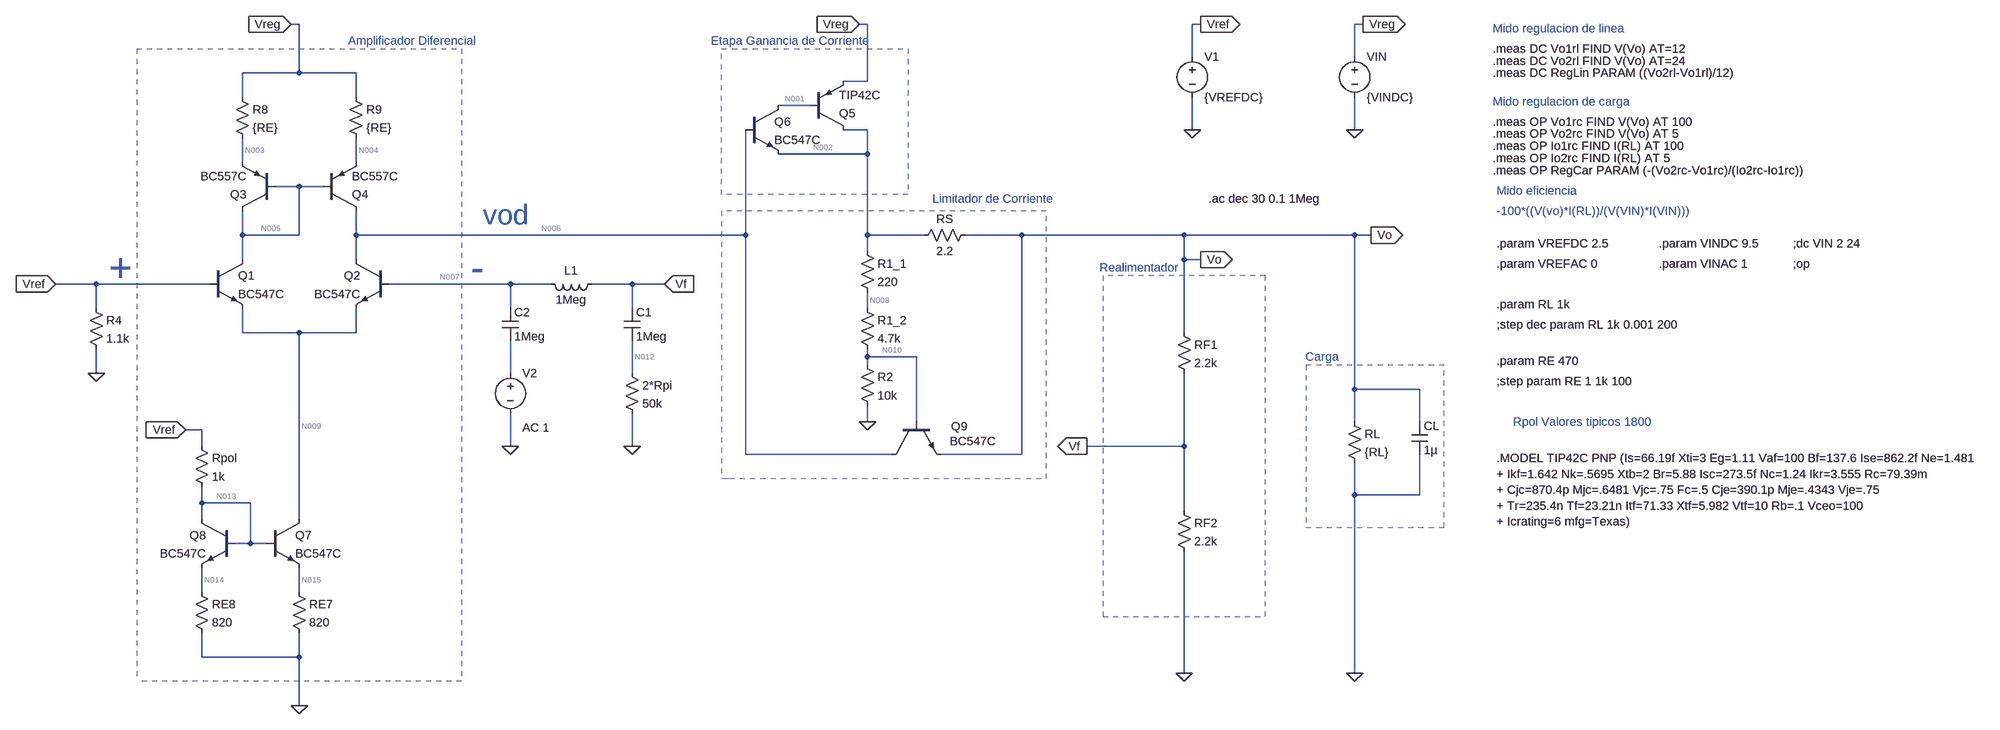
[diagram p0: schematic Ganancia de Lazo de Tension.asc]
Ganancia de Lazo de Tension.asc, the LTspice schematic file:
Version 4
SHEET 1 3616 1188
WIRE 208 -224 192 -224
WIRE 1328 -224 1312 -224
WIRE 1984 -224 1968 -224
WIRE 2304 -224 2288 -224
WIRE 1968 -160 1968 -224
WIRE 2288 -160 2288 -224
WIRE 208 -128 208 -224
WIRE 208 -128 96 -128
WIRE 320 -128 208 -128
WIRE 1328 -112 1328 -224
WIRE 1328 -112 1280 -112
WIRE 96 -80 96 -128
WIRE 320 -80 320 -128
WIRE 1216 -64 1152 -64
WIRE 1328 -16 1280 -16
WIRE 1968 -16 1968 -80
WIRE 2288 -16 2288 -80
WIRE 1328 32 1328 -16
WIRE 1328 32 1152 32
WIRE 96 48 96 0
WIRE 320 48 320 0
WIRE 208 96 160 96
WIRE 256 96 208 96
WIRE 96 192 96 144
WIRE 208 192 208 96
WIRE 208 192 96 192
WIRE 320 192 320 144
WIRE 1088 192 1088 -16
WIRE 1088 192 320 192
WIRE 1328 192 1328 32
WIRE 1440 192 1328 192
WIRE 1632 192 1520 192
WIRE 1952 192 1632 192
WIRE 2288 192 1952 192
WIRE 2320 192 2288 192
WIRE 1328 224 1328 192
WIRE 96 240 96 192
WIRE 320 240 320 192
WIRE 1952 240 1952 192
WIRE 1984 240 1952 240
WIRE -192 288 -272 288
WIRE 32 288 -192 288
WIRE 624 288 384 288
WIRE 704 288 624 288
WIRE 864 288 784 288
WIRE 928 288 864 288
WIRE -192 336 -192 288
WIRE 624 336 624 288
WIRE 864 336 864 288
WIRE 1328 336 1328 304
WIRE 96 384 96 336
WIRE 208 384 96 384
WIRE 320 384 320 336
WIRE 320 384 208 384
WIRE 1952 384 1952 240
WIRE 1328 432 1328 416
WIRE 1424 432 1328 432
WIRE 1328 448 1328 432
WIRE -192 464 -192 416
WIRE 624 464 624 400
WIRE 864 464 864 400
WIRE 2288 496 2288 192
WIRE 2416 496 2288 496
WIRE 1328 560 1328 528
WIRE 1424 560 1424 432
WIRE 2288 560 2288 496
WIRE 2416 560 2416 496
WIRE 16 576 -16 576
WIRE 16 608 16 576
WIRE 624 608 624 544
WIRE 864 608 864 544
WIRE 1952 608 1952 464
WIRE 1952 608 1760 608
WIRE 1088 624 1088 192
WIRE 1376 624 1088 624
WIRE 1632 624 1632 192
WIRE 1632 624 1472 624
WIRE 2288 704 2288 640
WIRE 2416 704 2416 624
WIRE 2416 704 2288 704
WIRE 16 720 16 688
WIRE 112 720 16 720
WIRE 1952 736 1952 608
WIRE 16 752 16 720
WIRE 208 752 208 384
WIRE 112 800 112 720
WIRE 112 800 80 800
WIRE 144 800 112 800
WIRE 16 896 16 848
WIRE 208 896 208 848
WIRE 16 1024 16 976
WIRE 208 1024 208 976
WIRE 208 1024 16 1024
WIRE 1952 1056 1952 816
WIRE 2288 1056 2288 704
WIRE 208 1120 208 1024
FLAG 2320 192 Vo
IOPIN 2320 192 Out
FLAG 1984 -224 Vref
IOPIN 1984 -224 Out
FLAG 1760 608 Vf
IOPIN 1760 608 Out
FLAG 1968 -16 0
FLAG 2304 -224 Vreg
IOPIN 2304 -224 Out
FLAG 2288 1056 0
FLAG 1952 1056 0
FLAG -272 288 Vref
IOPIN -272 288 In
FLAG -16 576 Vref
IOPIN -16 576 In
FLAG 2288 -16 0
FLAG 1312 -224 Vreg
IOPIN 1312 -224 In
FLAG 1328 560 0
FLAG -192 464 0
FLAG 928 288 Vf
IOPIN 928 288 In
FLAG 192 -224 Vreg
IOPIN 192 -224 In
FLAG 208 1120 0
FLAG 1984 240 Vo
IOPIN 1984 240 Out
FLAG 864 608 0
FLAG 624 608 0
DATAFLAG 16 288 ""
DATAFLAG 368 192 ""
DATAFLAG 112 192 ""
DATAFLAG 224 96 ""
DATAFLAG 320 32 ""
SYMBOL pnp 160 144 R180
SYMATTR InstName Q3
SYMATTR Value BC557C
SYMBOL pnp 256 144 M180
SYMATTR InstName Q4
SYMATTR Value BC557C
SYMBOL npn 32 240 R0
SYMATTR InstName Q1
SYMATTR Value BC547C
SYMBOL npn 384 240 M0
SYMATTR InstName Q2
SYMATTR Value BC547C
SYMBOL pnp 1216 -16 M180
SYMATTR InstName Q5
SYMATTR Value TIP42C
SYMBOL npn 1088 -64 R0
SYMATTR InstName Q6
SYMATTR Value BC547C
SYMBOL res 1936 368 R0
SYMATTR InstName RF1
SYMATTR Value 2.2k
SYMBOL res 1936 720 R0
SYMATTR InstName RF2
SYMATTR Value 2.2k
SYMBOL res 2272 544 R0
SYMATTR InstName RL
SYMATTR Value {RL}
SYMBOL voltage 1968 -176 R0
WINDOW 123 24 124 Left 2
WINDOW 39 0 0 Left 0
SYMATTR InstName V1
SYMATTR Value {VREFDC}
SYMBOL res 80 -96 R0
SYMATTR InstName R8
SYMATTR Value {RE}
SYMBOL res 304 -96 R0
SYMATTR InstName R9
SYMATTR Value {RE}
SYMBOL cap 2400 560 R0
SYMATTR InstName CL
SYMATTR Value 1µ
SYMBOL voltage 2288 -176 R0
WINDOW 123 24 124 Left 2
WINDOW 39 0 0 Left 0
SYMATTR InstName VIN
SYMATTR Value {VINDC}
SYMBOL npn 144 752 R0
SYMATTR InstName Q7
SYMATTR Value BC547C
SYMBOL npn 80 752 M0
SYMATTR InstName Q8
SYMATTR Value BC547C
SYMBOL res 0 592 R0
SYMATTR InstName Rpol
SYMATTR Value 1k
SYMBOL npn 1376 560 M90
WINDOW 0 9 117 VRight 2
WINDOW 3 38 114 VRight 2
SYMATTR InstName Q9
SYMATTR Value BC547C
SYMBOL res 1536 176 R90
WINDOW 0 0 56 VBottom 2
WINDOW 3 32 56 VTop 2
SYMATTR InstName RS
SYMATTR Value 2.2
SYMBOL res 1312 432 R0
SYMATTR InstName R2
SYMATTR Value 10k
SYMBOL res 1312 208 R0
SYMATTR InstName R1_1
SYMATTR Value 220
SYMBOL res -208 320 R0
SYMATTR InstName R4
SYMATTR Value 1.1k
SYMBOL res 192 880 R0
SYMATTR InstName RE7
SYMATTR Value 820
SYMBOL res 0 880 R0
SYMATTR InstName RE8
SYMATTR Value 820
SYMBOL res 1312 320 R0
SYMATTR InstName R1_2
SYMATTR Value 4.7k
SYMBOL res 848 448 R0
SYMATTR InstName 2*Rpi
SYMATTR Value 50k
SYMBOL ind 800 272 R90
WINDOW 0 5 56 VBottom 2
WINDOW 3 32 56 VTop 2
SYMATTR InstName L1
SYMATTR Value 1Meg
SYMBOL cap 848 336 R0
SYMATTR InstName C1
SYMATTR Value 1Meg
SYMBOL cap 608 336 R0
SYMATTR InstName C2
SYMATTR Value 1Meg
SYMBOL voltage 624 448 R0
WINDOW 123 24 124 Left 2
WINDOW 39 0 0 Left 0
SYMATTR InstName V2
SYMATTR Value ""
SYMATTR Value2 AC 1
TEXT 3152 248 Left 2 !;op
TEXT 2888 208 Left 2 !.param VINDC 9.5
TEXT 2888 248 Left 2 !.param VINAC 1
TEXT 2568 208 Left 2 !.param VREFDC 2.5
TEXT 2568 248 Left 2 !.param VREFAC 0
TEXT 2568 328 Left 2 !.param RL 1k
TEXT 3152 208 Left 2 !;dc VIN 2 24
TEXT 2568 480 Left 2 !;step param RE 1 1k 100
TEXT 2568 440 Left 2 !.param RE 470
TEXT 2568 368 Left 2 !;step dec param RL 1k 0.001 200
TEXT 2560 -216 Left 2 ;Mido regulacion de linea
TEXT 2560 -176 Left 2 !.meas DC Vo1rl FIND V(Vo) AT=12
TEXT 2560 -152 Left 2 !.meas DC Vo2rl FIND V(Vo) AT=24
TEXT 2560 -128 Left 2 !.meas DC RegLin PARAM ((Vo2rl-Vo1rl)/12)
TEXT 2560 -72 Left 2 ;Mido regulacion de carga
TEXT 2560 -32 Left 2 !.meas OP Vo1rc FIND V(Vo) AT 100
TEXT 2560 -8 Left 2 !.meas OP Vo2rc FIND V(Vo) AT 5
TEXT 2560 16 Left 2 !.meas OP Io1rc FIND I(RL) AT 100
TEXT 2560 40 Left 2 !.meas OP Io2rc FIND I(RL) AT 5
TEXT 2568 104 Left 2 ;Mido eficiencia
TEXT 2568 144 Left 2 ;-100*((V(vo)*I(RL))/(V(VIN)*I(VIN)))
TEXT 2560 64 Left 2 !.meas OP RegCar PARAM (-(Vo2rc-Vo1rc)/(Io2rc-Io1rc))
TEXT 2600 560 Left 2 ;Rpol Valores tipicos 1800
TEXT 2568 632 Left 2 !.MODEL TIP42C PNP (Is=66.19f Xti=3 Eg=1.11 Vaf=100 Bf=137.6 Ise=862.2f Ne=1.481  \n+ Ikf=1.642 Nk=.5695 Xtb=2 Br=5.88 Isc=273.5f Nc=1.24 Ikr=3.555 Rc=79.39m  \n+ Cjc=870.4p Mjc=.6481 Vjc=.75 Fc=.5 Cje=390.1p Mje=.4343 Vje=.75  \n+ Tr=235.4n Tf=23.21n Itf=71.33 Xtf=5.982 Vtf=10 Rb=.1 Vceo=100  \n+ Icrating=6 mfg=Texas)
TEXT -144 256 Center 6 ;+
TEXT 560 256 Center 6 ;-
TEXT 616 152 Center 5 ;vod
TEXT 304 -192 Left 2 ;Amplificador Diferencial
TEXT 1176 -192 Center 2 ;Etapa Ganancia de Corriente
TEXT 1576 120 Center 2 ;Limitador de Corriente
TEXT 1864 256 Center 2 ;Realimentador
TEXT 2224 432 Center 2 ;Carga
TEXT 2000 120 Left 2 !.ac dec 30 0.1 1Meg
LINE Normal 528 1072 -112 1072 1
LINE Normal -112 -176 -112 1072 1
LINE Normal 528 -176 528 1072 1
LINE Normal -112 -176 528 -176 1
LINE Normal 1408 112 1040 112 1
LINE Normal 1408 -176 1408 112 1
LINE Normal 1040 -176 1408 -176 1
LINE Normal 1040 112 1040 -176 1
LINE Normal 1680 144 1040 144 1
LINE Normal 1680 672 1680 144 1
LINE Normal 1056 672 1680 672 1
LINE Normal 1040 672 1056 672 1
LINE Normal 1040 144 1040 672 1
LINE Normal 1792 272 1792 592 1
LINE Normal 1792 592 1792 944 1
LINE Normal 2112 272 1792 272 1
LINE Normal 2112 944 2112 272 1
LINE Normal 1792 944 2112 944 1
LINE Normal 2464 448 2192 448 1
LINE Normal 2464 768 2464 448 1
LINE Normal 2192 768 2464 768 1
LINE Normal 2192 448 2192 768 1

The netlist it stands for:
* Ganancia de Lazo de Tension.asc
Q3 N005 N005 N003 0 BC557C
Q4 N006 N005 N004 0 BC557C
Q1 N005 Vref N009 0 BC547C
Q2 N006 N007 N009 0 BC547C
Q5 N002 N001 Vreg 0 TIP42C
Q6 N001 N006 N002 0 BC547C
RF1 Vo Vf 2.2k
RF2 Vf 0 2.2k
RL Vo 0 {RL}
V1 Vref 0 {VREFDC}
R8 Vreg N003 {RE}
R9 Vreg N004 {RE}
CL Vo 0 1µ
VIN Vreg 0 {VINDC}
Q7 N009 N013 N015 0 BC547C
Q8 N013 N013 N014 0 BC547C
Rpol Vref N013 1k
Q9 N006 N010 Vo 0 BC547C
RS Vo N002 2.2
R2 N010 0 10k
R1_1 N002 N008 220
R4 Vref 0 1.1k
RE7 N015 0 820
RE8 N014 0 820
R1_2 N008 N010 4.7k
R§2*Rpi N012 0 50k
L1 Vf N007 1Meg
C1 Vf N012 1Meg
C2 N007 N011 1Meg
V2 N011 0 AC 1
.model NPN NPN
.model PNP PNP
.lib standard.bjt
;op
.param VINDC 9.5
.param VINAC 1
.param VREFDC 2.5
.param VREFAC 0
.param RL 1k
;dc VIN 2 24
;step param RE 1 1k 100
.param RE 470
;step dec param RL 1k 0.001 200
* Mido regulacion de linea
.meas DC Vo1rl FIND V(Vo) AT=12
.meas DC Vo2rl FIND V(Vo) AT=24
.meas DC RegLin PARAM ((Vo2rl-Vo1rl)/12)
* Mido regulacion de carga
.meas OP Vo1rc FIND V(Vo) AT 100
.meas OP Vo2rc FIND V(Vo) AT 5
.meas OP Io1rc FIND I(RL) AT 100
.meas OP Io2rc FIND I(RL) AT 5
* Mido eficiencia
* -100*((V(vo)*I(RL))/(V(VIN)*I(VIN)))
.meas OP RegCar PARAM (-(Vo2rc-Vo1rc)/(Io2rc-Io1rc))
* Rpol Valores tipicos 1800
.MODEL TIP42C PNP (Is=66.19f Xti=3 Eg=1.11 Vaf=100 Bf=137.6 Ise=862.2f Ne=1.481
+ Ikf=1.642 Nk=.5695 Xtb=2 Br=5.88 Isc=273.5f Nc=1.24 Ikr=3.555 Rc=79.39m
+ Cjc=870.4p Mjc=.6481 Vjc=.75 Fc=.5 Cje=390.1p Mje=.4343 Vje=.75
+ Tr=235.4n Tf=23.21n Itf=71.33 Xtf=5.982 Vtf=10 Rb=.1 Vceo=100
+ Icrating=6 mfg=Texas)
* +
* -
* vod
* Amplificador Diferencial
* Etapa Ganancia de Corriente
* Limitador de Corriente
* Realimentador
* Carga
.ac dec 30 0.1 1Meg
.backanno
.end

* Results of the author's LTspice run, read from the files saved beside the schematic
* Operating Point, zero values left out:
*   V(n003) = 9.26 V
*   V(n004) = 9.257 V
*   V(vref) = 2.5 V
*   V(n007) = 2.502 V
*   V(vreg) = 9.5 V
*   V(vf) = 2.502 V
*   V(n013) = 1.467 V
*   V(n014) = 844.8 mV
*   V(n012) = 119.1 mV
*   V(n005) = 8.66 V
*   V(n006) = 5.579 V
*   V(n009) = 1.899 V
*   V(n002) = 5.03 V
*   V(n001) = 8.846 V
*   V(vo) = 5.016 V
*   V(n015) = 845.1 mV
*   V(n010) = 3.371 V
*   V(n008) = 4.956 V
*   Ic(Q1) = 511.1 µA
*   Ib(Q1) = 1.009 µA
*   Ie(Q1) = -512.1 µA
*   I(R8) = 510.1 µA
*   Ic(Q3) = -509 µA
*   Ib(Q3) = -1.145 µA
*   Ie(Q3) = 510.1 µA
*   Ic(Q6) = 67.32 µA
*   Ib(Q6) = 140.2 nA
*   Ie(Q6) = -67.46 µA
*   I(VIN) = -7.523 mA
*   I(RS) = -6.159 mA
*   I(RE8) = 1.03 mA
*   I(L1) = 3.575 µA
*   Ic(Q5) = -6.429 mA
*   Ib(Q5) = -67.32 µA
*   Ie(Q5) = 6.496 mA
*   Ic(Q8) = 1.028 mA
*   Ib(Q8) = 2.273 µA
*   Ie(Q8) = -1.03 mA
*   I(2*Rpi) = 2.382 µA
*   I(RF2) = 1.137 mA
*   I(R1_1) = 337.1 µA
*   I(C2) = 2.502 µA
*   I(C1) = 2.382 µA
*   I(R2) = 337.1 µA
*   I(RE7) = 1.031 mA
*   I(RF1) = 1.143 mA
*   I(V1) = -3.306 mA
*   Ic(Q7) = 1.028 mA
*   Ib(Q7) = 2.255 µA
*   Ie(Q7) = -1.031 mA
*   Ic(Q9) = 2.236 pA
*   Ib(Q9) = -3.883 pA
*   Ie(Q9) = 1.648 pA
*   Ic(Q4) = -515.2 µA
*   Ib(Q4) = -1.026 µA
*   Ie(Q4) = 516.3 µA
*   Ic(Q2) = 515.1 µA
*   Ib(Q2) = 1.073 µA
*   Ie(Q2) = -516.2 µA
*   I(RL) = 5.016 mA
*   I(R9) = 516.3 µA
*   I(R4) = 2.273 mA
*   I(R1_2) = 337.1 µA
*   I(V2) = 2.502 µA
*   I(Rpol) = 1.033 mA
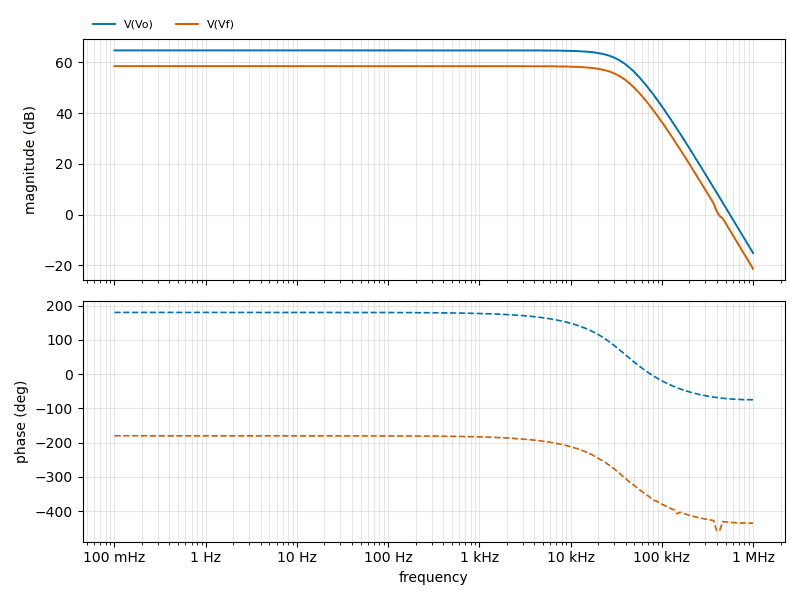
[diagram p1: AC Analysis of Ganancia de Lazo de Tension.asc, plotted from the saved traces]
* AC Analysis, 1 run:
*   V(Vo): 64.76 dB at 100 mHz, -15.16 dB at 1 MHz, peak 64.76 dB at 584.3 mHz, 3 dB below the peak at 30.6 kHz
*   V(Vf): 58.55 dB at 100 mHz, -21.37 dB at 1 MHz, peak 58.55 dB at 2.712 Hz, 3 dB below the peak at 30.6 kHz